# Altium schematic sheet usb_uart.SchDoc
size A4
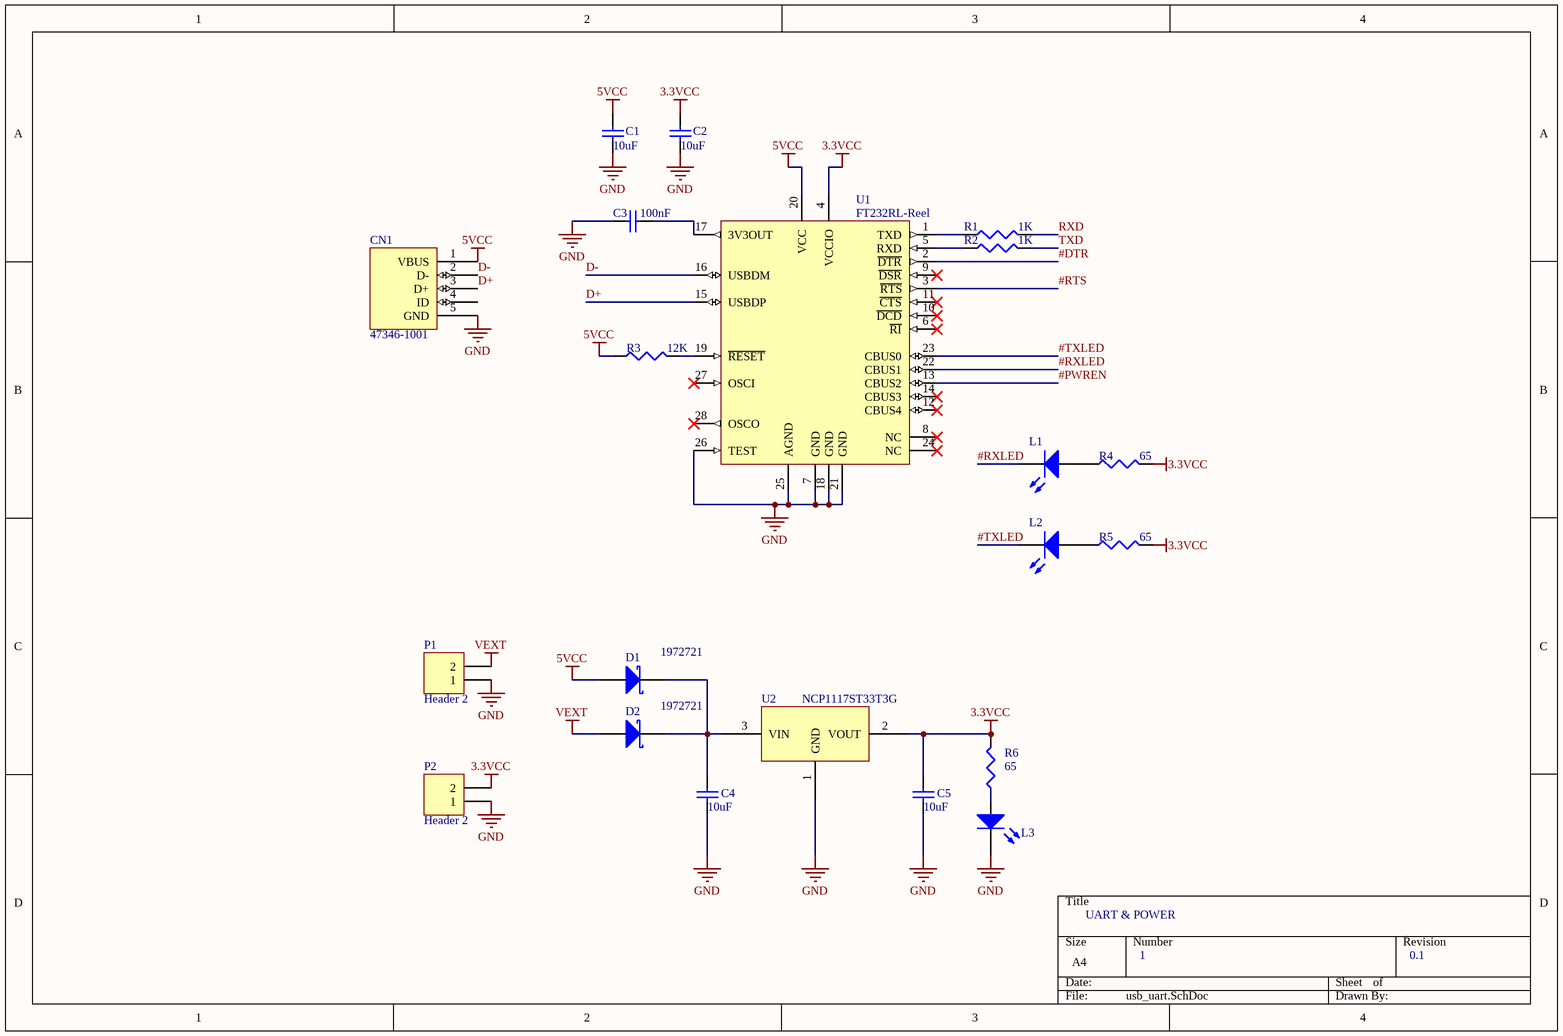
[diagram p0: usb_uart.SchDoc]

## Parts
C1  value 10uF  [C1206]  (hidden comment: Cap Semi)
C2  value 10uF  [C1206]  (hidden comment: Cap Semi)
C3  value 100nF  [C1206]  (hidden comment: Cap Semi)
C4  value 10uF  [C1206]  (hidden comment: Cap Semi)
C5  value 10uF  [C1206]  (hidden comment: Cap Semi)
CN1  47346-1001  [47346-1001]
D1  Supplier Part Number 1: 1972721  [SOD-128]  (hidden comment: PMEG3020DEP,115)
D2  Supplier Part Number 1: 1972721  [SOD-128]  (hidden comment: PMEG3020DEP,115)
L1  KM-23  [SOT-23]  (value not drawn)
L2  KM-23  [SOT-23]  (value not drawn)
L3  KM-23  [SOT-23]  (value not drawn)
P1  Header 2  [HDR1X2]
P2  Header 2  [HDR1X2]
R1  value 1K  [J1-0603]  (hidden comment: Res3)
R2  value 1K  [J1-0603]  (hidden comment: Res3)
R3  value 12K  [J1-0603]  (hidden comment: Res3)
R4  value 65  [J1-0603]  (hidden comment: Res3)
R5  value 65  [J1-0603]  (hidden comment: Res3)
R6  value 65  [J1-0603]  (hidden comment: Res3)
U1  FT232RL-Reel  [SSOP-28_N]
U2  NCP1117ST33T3G  [SOT-223-3]

## Nets
3.3VCC: C2.2 C5.1 P2.2 R4.2 R5.2 R6.2 U1.4(VCCIO) U2.2(VOUT)
5VCC: C1.2 CN1.1(VBUS) D1.2(A) R3.1 U1.20(VCC)
GND: C1.1 C2.1 C3.1 C4.1 C5.2 CN1.5(GND) L3.3(K) P1.1 P2.1 U1.7(GND) U1.18(GND) U1.21(GND) U1.25(AGND) U1.26(TEST) U2.1(GND)
VEXT: D2.2(A) P1.2
#DTR: U1.2(~{DTR})
#PWREN: U1.13(CBUS2)
#RTS: U1.3(~{RTS})
#RXLED: L1.3(K) U1.22(CBUS1)
#TXLED: L2.3(K) U1.23(CBUS0)
D+: CN1.3(D+) U1.15(USBDP)
D-: CN1.2(D-) U1.16(USBDM)
RXD: R1.2
TXD: R2.2
NetC3_2: C3.2 U1.17(3V3OUT)
NetC4_2: C4.2 D1.1(K) D2.1(K) U2.3(VIN)
NetL1_1: L1.1(A) R4.1
NetL2_1: L2.1(A) R5.1
NetL3_1: L3.1(A) R6.1
NetR1_1: R1.1 U1.1(TXD)
NetR2_1: R2.1 U1.5(RXD)
NetR3_2: R3.2 U1.19(~{RESET})

Not connected (* = marked no-connect by the designer): CN1 4(ID); U1 6(~{RI})* 8(NC)* 9(~{DSR})* 10(~{DCD})* 11(~{CTS})* 12(CBUS4)* 14(CBUS3)* 24(NC)* 27(OSCI)* 28(OSCO)*

## Notes on the sheet
- UART & POWER
- 1
- 0.1

## Library data of the parts
C1-C5 = Cap Semi: Capacitor (Semiconductor SIM Model); Published: 8-Jun-2000; LatestRevisionDate: 29-May-2009; LatestRevisionNote: IPC-7351 Footprint Added.; PackageReference: C1206; Publisher: Altium Limited; PackageDescription: Chip Capacitor
CN1 = 47346-1001: MOLEX - 47346-1001 - MULTIPOLE CONNECTOR Conector USB, Micro USB Tipo B, USB 2.0 Montaje Superficial,; Number of Circuits: 5; Pitch: 0.65mm; ComponentLink1Description: Farnell; ComponentLink1URL: https://es.farnell.com/molex/47346-1001/conector-micro-usb-tipo-b-hembra/dp/2782045?st=Conector%20USB,%20Micro%20USB%20Tipo%20B; Supplier 1: Farnell; Manufacturer: Molex; Manufacturer Part Number: 47346-1001; Stock 1: 336; Pricing 1: 1=0.624, 60=0.6, 200=0.556, 500=0.532, 1000=0.503 (EUR); Mount: Surface Mount; Contact Material: Copper Alloy; Contact Plating: Gold; Housing Material: Polymer; Min Operating Temperature: -30°C; Max Operating Temperature: 85°C; Orientation: Right Angle; Termination: Solder; Length: 7.8mm; REACH SVHC: No SVHC; Halogen Free: Low Halogen
D1 D2 = PMEG3020DEP,115: NEXPERIA - Rectificador Schottky, 30 V, 2 A; Manufacturer: NXP Semiconductors; Forward Current: 2A; Max Repetitive Reverse Voltage (Vrrm): 30V; Element Configuration: Single; Forward Voltage: 520mV; Peak Reverse Current: 50uA; Peak Non-Repetitive Surge Current: 50A; Max Power Dissipation: 625mW; ComponentLink1Description: farnell; ComponentLink1URL: https://es.farnell.com/nexperia/pmeg3020dep-115/diodo-schott-rect-30v-2a-sod128/dp/1972721?st=PMEG3020DEP,115; Supplier 1: Farnell; Manufacturer Part Number: PMEG3020DEP,115; Stock 1: 4; Pricing 1: 5=0.351, 25=0.27, 100=0.189, 250=0.167, 500=0.145, 1000=0.123, 5000=0.106 (EUR); Mount: Surface Mount; Number of Pins: 2; Min Operating Temperature: -55°C; Max Operating Temperature: 150°C; Packaging: Tape and Reel; Max Surge Current: 50A; Package Quantity: 3000; Max Reverse Leakage Current: 50uA; Average Rectified Current: 2A; Max Reverse Voltage (DC): 30V; Radiation Hardening: No; Lead Free: Lead Free; ComponentLink2URL: http://www.nxp.com/documents/data_sheet/PMEG3020DEP.pdf?ecmp=mouser; ComponentLink2Description: http://www.nxp.com/documents/data_sheet/PMEG3020DEP.pdf?ecmp=mouser; ComponentLink3URL: http://www.nxp.com/documents/data_sheet/PMEG3020DEP.pdf; ComponentLink3Description: http://www.nxp.com/documents/data_sheet/PMEG3020DEP.pdf
L1-L3 = KM-23: Kingbright - LED, SOT-23; Manufacturer Part Number: KM-23ID-F; Colour: Red; Lens Colour: Clear; Viewing Angle: 140°; Forward Voltage: 2V; Lens Style: Colored,Diffused,Rectangular; Luminous Intensity: 12mcd; Wavelength: 625nm; Forward Current: 20mA; Number of LEDs: 1; ComponentLink1Description: farnell -RED; ComponentLink1URL: https://es.farnell.com/kingbright/km-23id-f/led-red-sot-23-smd/dp/2099216?st=KM-23ID; ComponentLink2Description: farnell-Green; ComponentLink2URL: https://es.farnell.com/kingbright/km-23sgd-f/led-green-sot-23-smd/dp/2099217?st=KM-23; Supplier 1: Farnell; Manufacturer: Kingbright; Stock 1: 10839; Pricing 1: 5=0.118, 25=0.112, 100=0.106, 250=0.101, 500=0.0968, 1000=0.0928 (GBP); Mount: Surface Mount; Case/Package: SOT-23; Number of Pins: 3; Dominant Wavelength: 625nm; Length: 2.8mm; Height: 1mm; Width: 1.2mm; Radiation Hardening: No; REACH SVHC: No SVHC; ComponentLink3URL: http://www.farnell.com/datasheets/1563685.pdf; ComponentLink3Description: http://www.farnell.com/datasheets/1563685.pdf; ComponentLink4URL: https://www.distrelec.biz/Web/Downloads/d_/en/cuKingbright_SOT-23_SMT-LED_EN.pdf?mime=application%2Fpdf; ComponentLink4Description: https://www.distrelec.biz/Web/Downloads/d_/en/cuKingbright_SOT-23_SMT-LED_EN.pdf?mime=application%2Fpdf; ComponentLink5URL: http://uk.rs-online.com/webdocs/032f/0900766b8032f166.pdf; ComponentLink5Description: http://uk.rs-online.com/webdocs/032f/0900766b8032f166.pdf; ComponentLink6URL: http://www.produktinfo.conrad.com/datenblaetter/175000-199999/180090-da-01-en-LED_SOT23_TYP_KM_23ID_F.pdf; ComponentLink6Description: http://www.produktinfo.conrad.com/datenblaetter/175000-199999/180090-da-01-en-LED_SOT23_TYP_KM_23ID_F.pdf; ComponentLink7URL: http://www.produktinfo.conrad.com/datenblaetter/125000-149999/144223-da-01-en-SMD_Leuchtdioden_KM23ID_Sot23_rot.pdf; ComponentLink7Description: http://www.produktinfo.conrad.com/datenblaetter/125000-149999/144223-da-01-en-SMD_Leuchtdioden_KM23ID_Sot23_rot.pdf
P1 P2 = Header 2: Header, 2-Pin; LatestRevisionDate: 17-Jul-2002; LatestRevisionNote: Re-released for DXP Platform.; Publisher: Altium Limited
R1-R6 = Res3: Resistor; Published: 8-Jun-2000; LatestRevisionDate: 29-May-2009; LatestRevisionNote: IPC-7351 Footprint Added.; PackageReference: J1-0603; Publisher: Altium Limited; PackageDescription: Chip Resistor
U1 = FT232RL-Reel: USB UART Asynchronous Serial Data Transfer Chip, SSOP-28, Tape and Reel; Published: 19-Aug-2010; DatasheetVersion: ver 2.07, Jul-2010; PackageVersion: 2010; PackageReference: SSOP-28; Publisher: Altium Limited; PackageDescription: 28-Pin Small Outline Package 0.65 mm Pitch; ComponentLink1Description: Manufacturer Link; ComponentLink1URL: http://www.ftdichip.com/Products/ICs/FT232R.htm; ComponentLink2Description: Datasheet; ComponentLink2URL: http://www.ftdichip.com/Support/Documents/DataSheets/ICs/DS_FT232R.pdf
U2 = NCP1117ST33T3G: ON SEMICONDUCTOR  - Regulador de Tensión Fija LDO 3.3V 1A; Max Input Voltage: 20V; Number of Outputs: 1; Dropout Voltage: 1.07V; Max Supply Voltage: 15V; Min Supply Voltage: 4.75V; Min Input Voltage: 3.5V; Input Bias Current: 6mA; Quiescent Current: 10mA; Polarity: Positive; Reference Voltage: 1.25V; Accuracy: 1%; Output Type: Fixed; ComponentLink1Description: farnell; ComponentLink1URL: https://es.farnell.com/on-semiconductor/ncp1117st33t3g/ic-linear-voltage-regulator/dp/1652366?st=NCP1117ST33T3G; Supplier 1: Farnell; Manufacturer: ON Semiconductor; Manufacturer Part Number: NCP1117ST33T3G; Stock 1: 0; Pricing 1: 150=0.196, 250=0.174, 500=0.151, 1000=0.129, 5000=0.121, 10000=0.116 (EUR); Mount: Surface Mount; Case/Package: SOT-223; Number of Pins: 3; Contact Plating: Matte,Tin; Min Operating Temperature: 0°C; Max Operating Temperature: 125°C; Output Voltage: 3.3V; Packaging: Tape and Reel; Output Current: 1A; Max Output Current: 1A; Package Quantity: 1; Nominal Output Voltage: 3.3V; Number of Regulators: 1; Min Current Limit: 1A; Min Output Voltage: 3.3V; Max Output Voltage: 3.3V; Termination: SMD/SMT; Output Voltage Accuracy: 1%; Length: 6.7mm; Height: 1.69mm; Width: 3.7mm; Radiation Hardening: No; REACH SVHC: No SVHC; Lead Free: Lead Free; Halogen Free: Halogen Free; ComponentLink2URL: http://www.onsemi.ru.com/pub/Collateral/NCP1117-D.PDF; ComponentLink2Description: http://www.onsemi.ru.com/pub/Collateral/NCP1117-D.PDF; ComponentLink3URL: http://www.farnell.com/datasheets/1726422.pdf; ComponentLink3Description: http://www.farnell.com/datasheets/1726422.pdf; ComponentLink4URL: http://www.onsemi.com/pub/Collateral/NCP1117-D.PDF; ComponentLink4Description: http://www.onsemi.com/pub/Collateral/NCP1117-D.PDF; ComponentLink5URL: https://www.verical.com/server-webapp/html/getDatasheet?partID=82718; ComponentLink5Description: https://www.verical.com/server-webapp/html/getDatasheet?partID=82718; ComponentLink6URL: http://www.farnell.com/datasheets/1748260.pdf; ComponentLink6Description: http://www.farnell.com/datasheets/1748260.pdf; ComponentLink7URL: http://www.onsemi.com/pub_link/Collateral/NCP1117-D.PDF; ComponentLink7Description: http://www.onsemi.com/pub_link/Collateral/NCP1117-D.PDF